# Altium schematic sheet CT100-array.SchDoc
size A; SheetNumber: 1; SheetTotal: 2
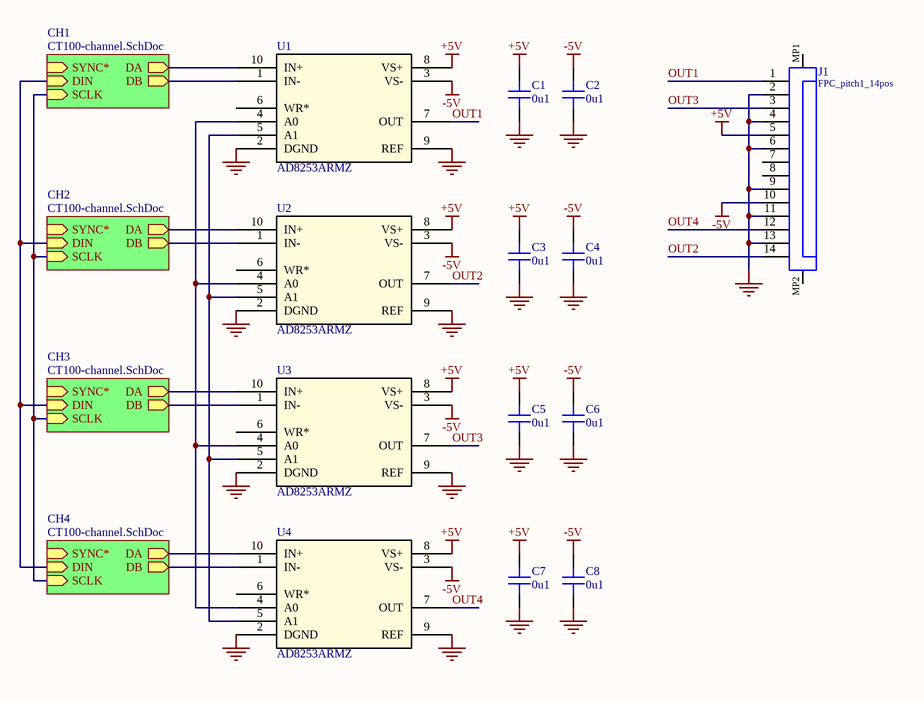
[diagram p0: CT100-array.SchDoc]

## Parts
C1  0u1  [CAP_0402]
C2  0u1  [CAP_0402]
C3  0u1  [CAP_0402]
C4  0u1  [CAP_0402]
C5  0u1  [CAP_0402]
C6  0u1  [CAP_0402]
C7  0u1  [CAP_0402]
C8  0u1  [CAP_0402]
J1  FPC_pitch1_14pos  [FPC_pitch1_14pos]
U1  AD8253ARMZ  [RM_10_ADI]
U2  AD8253ARMZ  [RM_10_ADI]
U3  AD8253ARMZ  [RM_10_ADI]
U4  AD8253ARMZ  [RM_10_ADI]

## Sub-sheets
CH1 = CT100-channel.SchDoc: SYNC* (in), DIN (in), SCLK (in), DA (out), DB (out)
CH2 = CT100-channel.SchDoc: SYNC* (in), DIN (in), SCLK (in), DA (out), DB (out)
CH3 = CT100-channel.SchDoc: SYNC* (in), DIN (in), SCLK (in), DA (out), DB (out)
CH4 = CT100-channel.SchDoc: SYNC* (in), DIN (in), SCLK (in), DA (out), DB (out)

## Nets
+5V: C1.1 C3.1 C5.1 C7.1 J1.5 U1.8(VS+) U2.8(VS+) U3.8(VS+) U4.8(VS+)
-5V: C2.1 C4.1 C6.1 C8.1 J1.10 U1.3(VS-) U2.3(VS-) U3.3(VS-) U4.3(VS-)
GND: C1.2 C2.2 C3.2 C4.2 C5.2 C6.2 C7.2 C8.2 J1.2 J1.4 J1.6 J1.9 J1.11 J1.13 U1.2(DGND) U1.9(REF) U2.2(DGND) U2.9(REF) U3.2(DGND) U3.9(REF) U4.2(DGND) U4.9(REF)
OUT1: J1.1 U1.7(OUT)
OUT2: J1.14 U2.7(OUT)
OUT3: J1.3 U3.7(OUT)
OUT4: J1.12 U4.7(OUT)
NetU1_1: U1.1(IN-) ; sheet CH1/DB
NetU1_4: U1.4(A0) U2.4(A0) U3.4(A0) U4.4(A0)
NetU1_5: U1.5(A1) U2.5(A1) U3.5(A1) U4.5(A1)
NetU1_10: U1.10(IN+) ; sheet CH1/DA
NetU2_1: U2.1(IN-) ; sheet CH2/DB
NetU2_10: U2.10(IN+) ; sheet CH2/DA
NetU3_1: U3.1(IN-) ; sheet CH3/DB
NetU3_10: U3.10(IN+) ; sheet CH3/DA
NetU4_1: U4.1(IN-) ; sheet CH4/DB
NetU4_10: U4.10(IN+) ; sheet CH4/DA
(unnamed): sheet CH1/DIN, sheet CH2/DIN, sheet CH3/DIN, sheet CH4/DIN
(unnamed): sheet CH1/SCLK, sheet CH2/SCLK, sheet CH3/SCLK, sheet CH4/SCLK

Not connected (* = marked no-connect by the designer): J1 7 8 MP1 MP2; U1 6(WR*); U2 6(WR*); U3 6(WR*); U4 6(WR*)

## Library data of the parts
C1-C8 = CAP_0402: Capacitor SMD 0402; Voltage: 50V; Capacitance: 0u1
J1 = FPC_pitch1_14pos: 14 Position 1 mm FFC & FPC Connectors
U1-U4 = AD8253ARMZ: No Description Available; Mfr_Name: Analog Devices Inc; Copyright: Copyright (C) 2023 Ultra Librarian. All rights reserved.; Manufacturer_Part_Number: AD8253ARMZ; RefDes: RefDes; Type: DEV